# EAGLE design Podkładka.pod.kubek.1_Bartosz.Kępa (EAGLE 9.7.0)
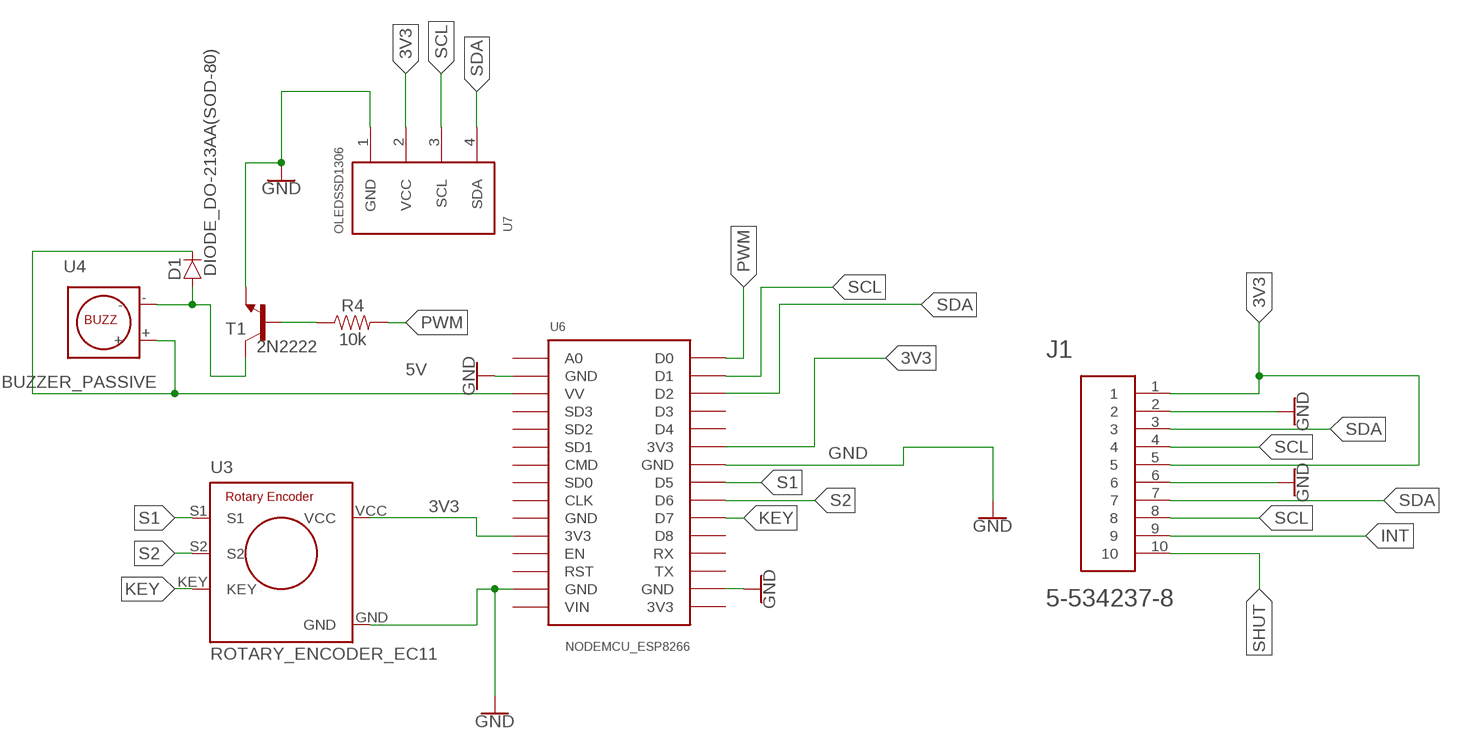
[diagram p0: schematic, sheet 1]

## Parts
D1  DIODE_DO-213AA(SOD-80)  [DIOMELF3516]
J1  5-534237-8  [5-534237-8]
OLEDSSD1306  I2C_OLED  [I2C_OLED_PACKAGE]
R4  10k  10KOHM-HORIZ-1/4W-1%  [AXIAL-0.3]
T1  2N2222  [TO92-EBC-OVAL]
U3  ROTARY_ENCODER_EC11  [EC11_ROTARY_ENCODER]
U4  BUZZER_PASSIVE  [BUZZER_PASSIVE_12MM]
U6  NODEMCU_ESP8266  [NODEMCU_ESP8266]

## Nets
3V3: J1.1 J1.5 OLEDSSD1306.2(VCC) U3.VCC U6.3V3@2(3V3) U6.3V3@3(3V3)
5V: D1.1(C) U4.+ U6.VV
GND: J1.2 J1.6 OLEDSSD1306.1(GND) T1.E U3.GND U6.GND@1(GND) U6.GND@2(GND) U6.GND@4(GND) U6.GND@5(GND)
INT: J1.9
KEY: U3.KEY U6.D7
N$1: R4.P$1 T1.B
N$2: D1.2(A) T1.C U4.-
PWM: R4.P$2 U6.D0
S1: U3.S1 U6.D5
S2: U3.S2 U6.D6
SCL: J1.4 J1.8 OLEDSSD1306.3(SCL) U6.D1
SDA: J1.3 J1.7 OLEDSSD1306.4(SDA) U6.D2
SHUT: J1.10
Unconnected: U6.A0 U6.CLK U6.CMD U6.D3 U6.D4 U6.D8 U6.EN U6.RST U6.RX U6.SD1 U6.SD2 U6.SD3 U6.SDO(SD0) U6.TX

## Power pins joined to a net without a drawn wire
3V3: U6.3V3@1(3V3)
GND: U6.GND@3(GND)
VIN: U6.VIN

## Library data of the parts
D1 = Diode:DIODE: Diode Rectifier - Generic; CATEGORY: Diode; DESCRIPTION: Generic diode Surface Mount DO-213AA(SOD-80); PACKAGE_SIZE: SOD-80; PACKAGE_TYPE: Surface Mount; SUBCATEGORY: Rectifiers
J1 = Connectors:5-534237-8: CONN RCPT 10POS 0.1 GOLD PCB Manufacturer's datasheet <https://www.te.com/commerce/DocumentDelivery/DDEController?Action=srchrtrv&DocNm=534237&DocType=Customer+Drawing&DocLang=English>; CREATED_BY: PCBLayout.com; DIGIKEY_PART_NUMBER: A32910-ND; MANUFACTURER: TE Connectivity AMP Connectors; MPN: 5-534237-8
OLEDSSD1306 = DIYMall_OLED:I2C_OLED
R4 = SparkFun-Resistors:10KOHM: 10kΩ resistor A resistor is a passive two-terminal electrical component that implements electrical resistance as a circuit element. Resistors act to reduce current flow, and, at the same time, act to lower voltage levels within circuits. - Wikipedia; PROD_ID: RES-12183
T1 = adafruit:2N2222: NPN TRANSISTOR Big oval pads
U3 = eagle_lib_peripherals:ROTARY_ENCODER_EC11: EC11 Rotary Encoder with Push Button Pulses: 20 per rotation Pins: S1, S2, KEY, VCC, GND
U4 = eagle_lib_peripherals:BUZZER_PASSIVE: Passive Piezo Buzzer Diameter: 12mm Voltage: 3-12V
U6 = nodemcu_esp8266:NODEMCU_ESP8266: Node MCU V2 (ESP8266) Created by Harish

## Board
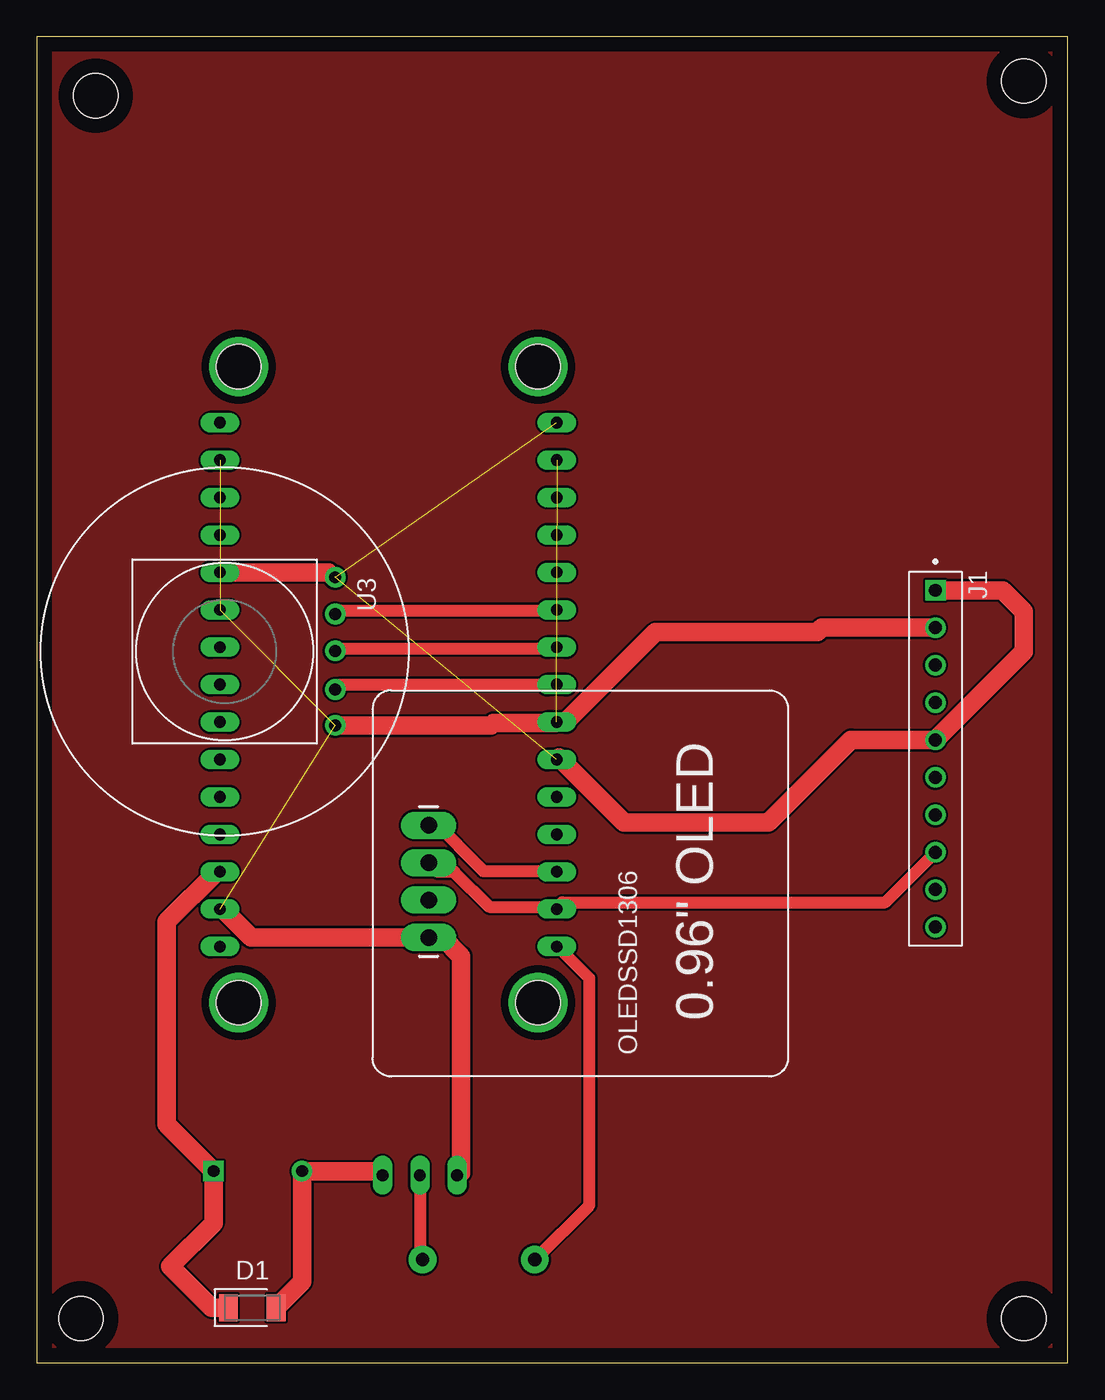
[diagram p1: board, top side]
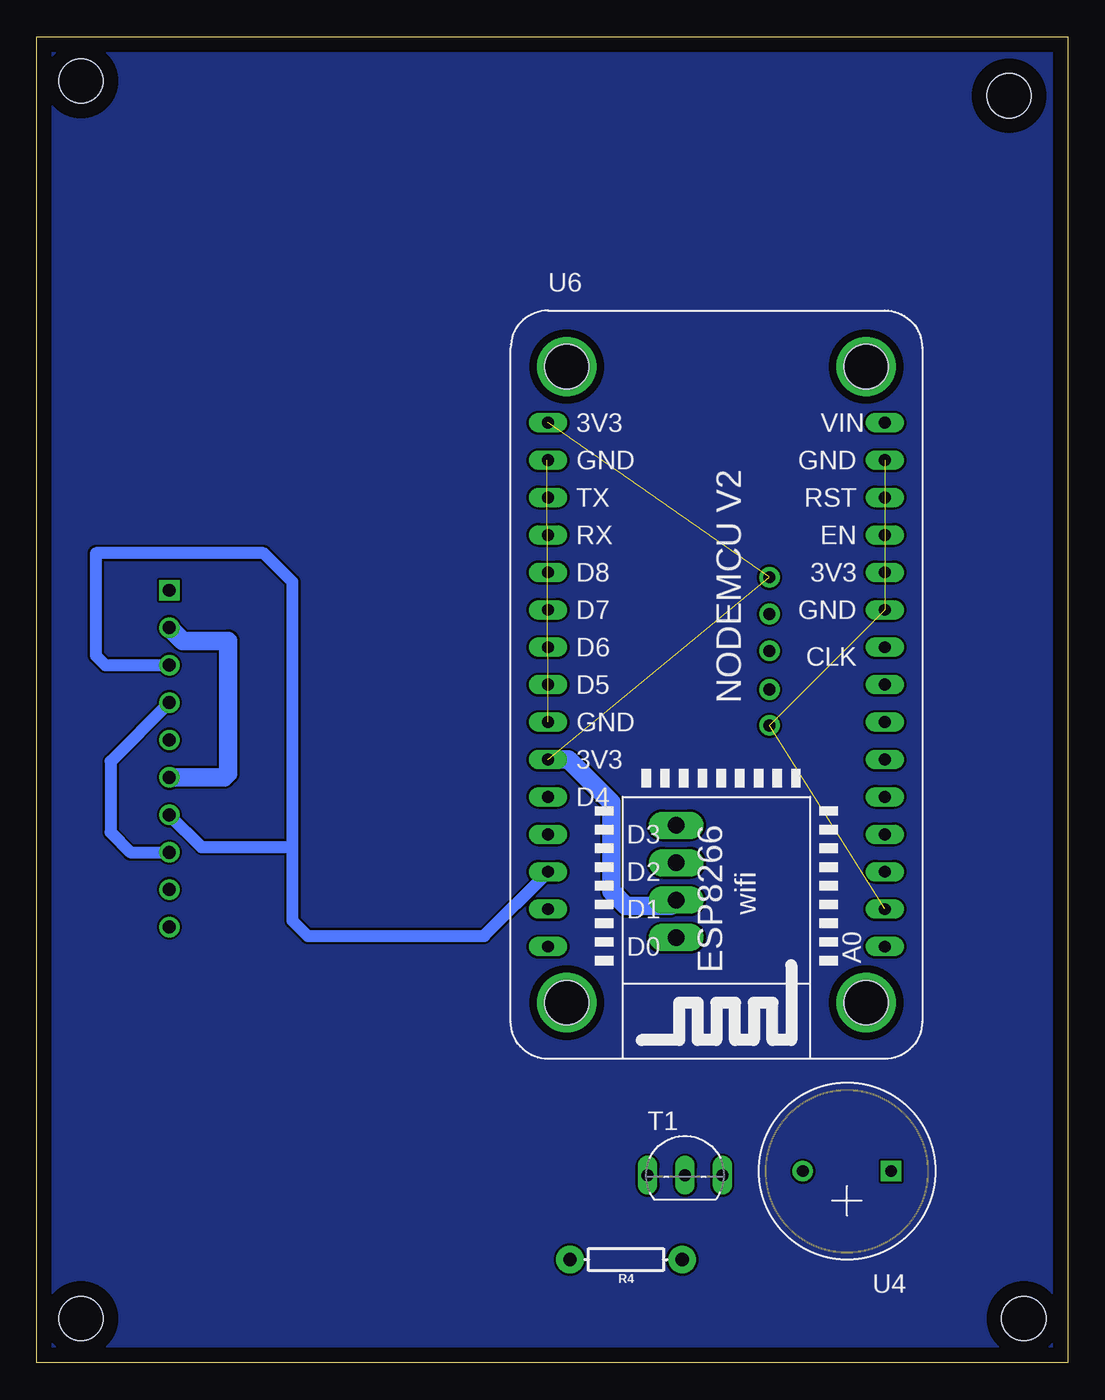
[diagram p2: board, bottom side, seen from below]

Size 70 x 90 mm. Coordinates in mm from the lower left corner, seen from the top.
Outline: 0,0 70,0 70,90 0,90 0,0
Copper layers (1*16): Top 0.035mm / dielectric 1.5mm / Bottom 0.035mm
Design rules "Fusion Electronics Design Rules": minimum track width 6mil, minimum drill 0.35mm, track to track 6mil, track to pad 6mil, pad to pad 6mil, via to via 6mil, smd to smd 6mil, copper to edge 40mil, drill to drill 6mil, minimum pad ring 10mil, minimum via ring 8mil, stop-mask expansion 4mil, vias tented up to drill 9999mil, thermal gap 10mil
Holes 3 mm at 3,3 4,86 67,3 67,87

### Footprints (pad centres in the part's own frame; a part is rotated, then mirrored left to right if it is on the bottom)
DIOMELF3516 = smd 1.275 x 1.85: 1 -1.62,0; 2 1.62,0
5-534237-8 = drill 0.88 square: 1 -11.43,0 | drill 0.88: 2 -8.89,0; 3 -6.35,0; 4 -3.81,0; 5 -1.27,0; 6 1.27,0; 7 3.81,0; 8 6.35,0; 9 8.89,0; 10 11.43,0
I2C_OLED_PACKAGE = drill 1.118 pad 1.88 long: 1 9,24; 2 11.54,24; 3 14.08,24; 4 16.62,24
AXIAL-0.3 = drill 0.9 pad 1.88: P$1 -3.81,0; P$2 3.81,0
TO92-EBC-OVAL = drill 0.813 long: B 0,-1.27; C 2.54,-1.27; E -2.54,-1.27
EC11_ROTARY_ENCODER = drill 0.8 pad 1.4: GND 5.015,7.5; KEY -2.54,7.5; S1 2.58,7.5; S2 -0.04,7.5; VCC -5.04,7.5
BUZZER_PASSIVE_12MM = drill 0.8 pad 1.4 square: + -3,0 | drill 0.8 pad 1.4: - 3,0
NODEMCU_ESP8266 = drill 0.8 long: 3V3@1 -11.43,19.05; 3V3@2 -11.43,-3.81; 3V3@3 11.43,8.89; A0 11.43,-16.51; CLK 11.43,3.81; CMD 11.43,-1.27; D0 -11.43,-16.51; D1 -11.43,-13.97; D2 -11.43,-11.43; D3 -11.43,-8.89; D4 -11.43,-6.35; D5 -11.43,1.27; D6 -11.43,3.81; D7 -11.43,6.35; D8 -11.43,8.89; EN 11.43,11.43; GND@1 -11.43,16.51; GND@2 -11.43,-1.27; GND@3 11.43,6.35; GND@4 11.43,16.51; GND@5 11.43,-13.97; RST 11.43,13.97; RX -11.43,11.43; SD1 11.43,-3.81; SD2 11.43,-6.35; SD3 11.43,-8.89; SDO 11.43,1.27; TX -11.43,13.97; VIN 11.43,19.05; VV 11.43,-11.43 | drill 3: P$31 10.16,22.86; P$32 -10.16,22.86; P$33 -10.16,-20.32; P$34 10.16,-20.32 | hole 3: 10.16,22.86; 10.16,-20.32; -10.16,-20.32; -10.16,22.86

### Placement (x,y rotation side)
D1  14.63,3.73 0 top
J1  61,41 270 top
OLEDSSD1306  50.6,19.86 90 top
R4  30,7 180 bottom
T1  26,14 0 bottom
U3  12.76,48.28 270 top
U4  15,13 180 bottom
U6  23.86,44.76 0 bottom

### Tracks (layer width: path | path; a pad name or v marks a point on that pad's centre or on a via)
3V3  (2 unrouted)
  Top 0.152: 12.5,53.65 U6.3V3@3
  Top 0.254: U3.VCC 20.27,53.34
  Top 0.406: 20.12,53.34 19.81,53.65 | U6.3V3@2 35.45,41.08
  Top 1.27: U3.VCC 20.12,53.34 | 19.81,53.65 12.5,53.65 | 35.45,41.08 39.85,36.68 49.68,36.68 55.27,42.27 J1.5 67,48.27 67,51 65.57,52.43 J1.1
  Bottom 1.27: U6.3V3@2 33.92,40.95 30.98,38.02 30.98,31.98 30,31 27,31 OLEDSSD1306.2
5V
  Top 0.406: U4.+ 11.89,13.11
  Top 1.27: 11.89,13.11 8.82,16.17 8.82,29.94 12.21,33.33 U6.VV | U4.+ 12,9.46 9.07,6.53 11.86,3.73 D1.1
GND  (4 unrouted)
  Top 0.152: 35.36,61.27 U6.GND@1 | U6.GND@2 35.2,43.43 | 31,43.43 30.96,43.43
  Top 1.27: U6.GND@2 35.89,43.48 42,49.6 53,49.6 53.29,49.89 J1.2 | 35.2,43.43 31,43.43 30.83,43.26 U3.GND | U6.GND@5 12.61,30.79 14.54,28.86 OLEDSSD1306.1 27.54,28.86 28.8,27.59 28.8,12.9 T1.E
  Bottom 0.305: 57,40 57.27,39.73
  Bottom 1.27: J1.2 60.11,49 57,49 57,40 | 57.27,39.73 J1.6
KEY
  Top 0.254: 20.27,50.9 20.42,51.05
  Top 0.813: U3.KEY 20.27,50.9 | 20.42,51.05 35.2,51.05 U6.D7
N$1
  Top 0.152: R4.P$1 26.06,7.01 | 26.06,12.65 T1.B
  Top 0.813: 26.06,7.01 26.06,12.65
N$2
  Top 1.27: T1.C 23.19,13 U4.- 18,5.48 D1.2
N$3
  pour Bottom: 0.08,0.08 69.92,0.08 69.92,89.92 0.08,89.92
N$4
  pour Top: 0.08,0.08 69.92,0.08 69.92,89.92 0.08,89.92
PWM
  Top 0.152: R4.P$2 33.83,7.01
  Top 0.813: 33.83,7.01 37.52,10.69 37.52,26.09 35.36,28.25 U6.D0
S1
  Top 0.152: U3.S1 20.27,45.72
  Top 0.813: 20.27,45.72 20.57,46.02 35.2,46.02 U6.D5
S2
  Top 0.254: U3.S2 20.27,48.46
  Top 0.813: 20.27,48.46 35.2,48.46 U6.D6
SCL
  Top 0.152: U6.D1 35.36,30.94
  Top 0.813: U6.D1 35.2,30.94 30.72,30.94 28.33,33.33 27.21,33.33 OLEDSSD1306.3 | 35.36,30.94 35.66,31.24 57.59,31.24 J1.8
  Bottom 0.813: J1.4 65,40.81 65,36 63.65,34.65 J1.8
SDA
  Top 0.813: OLEDSSD1306.4 26.85,36.83 30.3,33.38 35.2,33.38 U6.D2
  Bottom 0.152: U6.D2 35.36,33.22
  Bottom 0.813: 35.36,33.22 39.62,28.96 51.6,28.96 52.65,30 52.65,35 | 52.65,35 52.65,53 54.6,54.96 66,54.96 66,48 65.35,47.35 J1.3 | J1.7 58.81,35 52.65,35